# Altium schematic sheet k26_baseboard_power_supply.SchDoc: k26 Baseboard Power Supply (part 1 of 3)
size A3; DrawnBy: Ch. Vogt; Engineer: Ch. Vogt; Organization: PBL; DocumentNumber: 1; Revision: r5; SheetNumber: 4
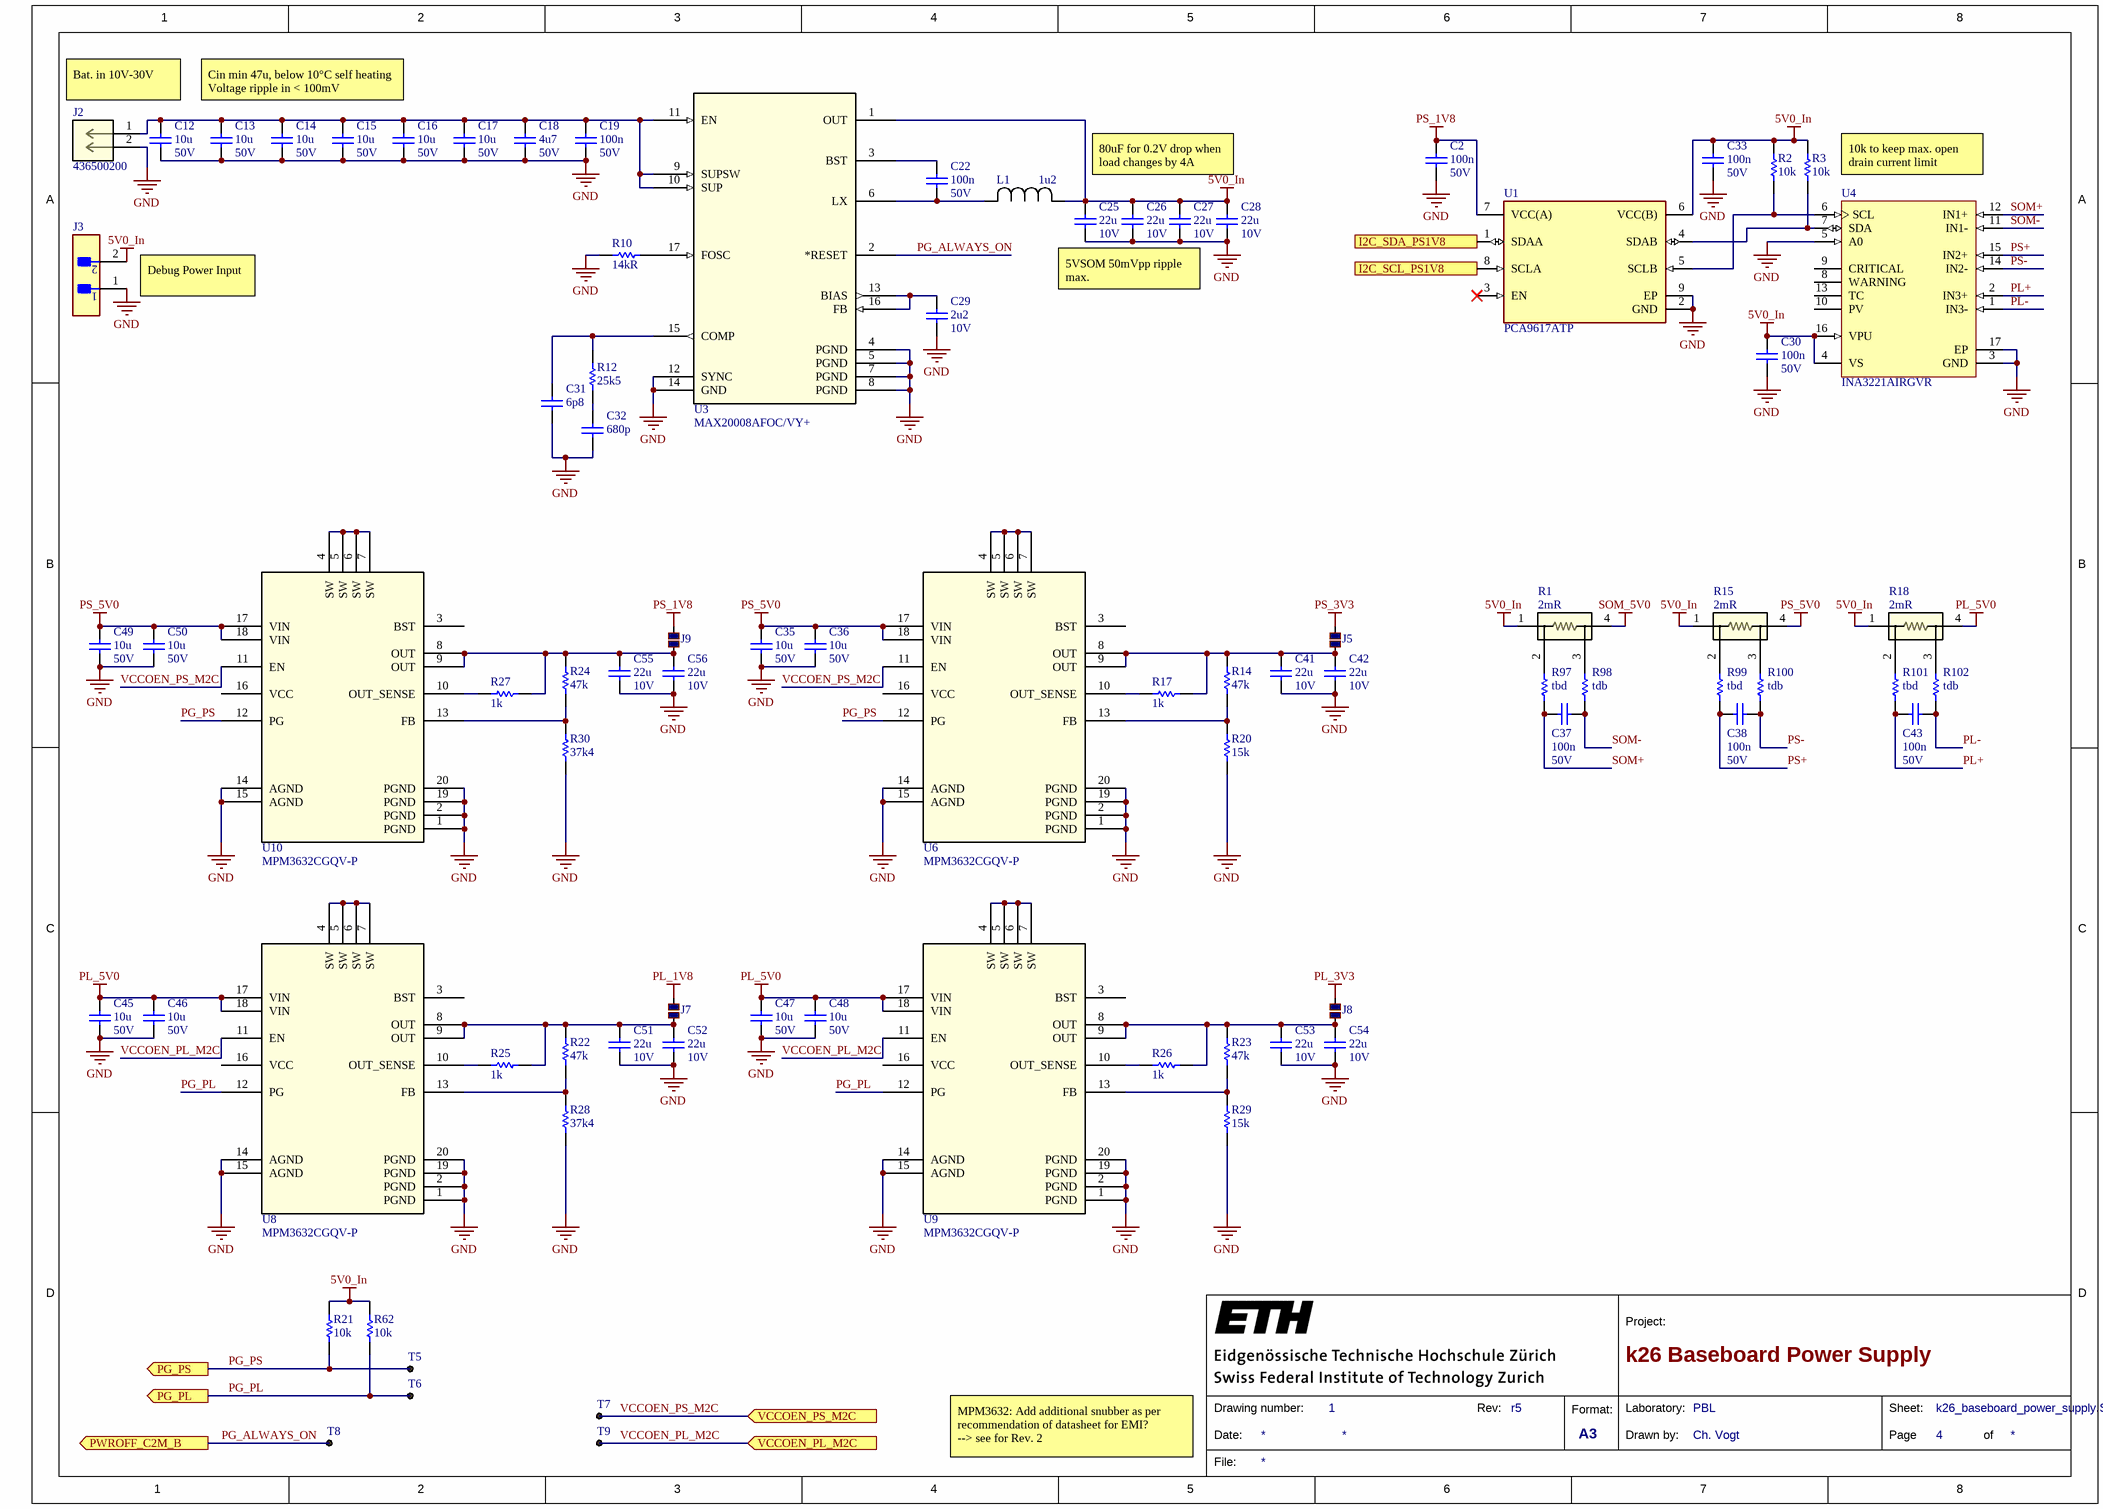
[diagram p0: k26_baseboard_power_supply.SchDoc]

## Parts
C2  100n  Rated DC Voltage (URdc): 50V  [CAPC0402]
C12  10u  Rated DC Voltage (URdc): 50V  [CAPC1206]
C13  10u  Rated DC Voltage (URdc): 50V  [CAPC1206]
C14  10u  Rated DC Voltage (URdc): 50V  [CAPC1206]
C15  10u  Rated DC Voltage (URdc): 50V  [CAPC1206]
C16  10u  Rated DC Voltage (URdc): 50V  [CAPC1206]
C17  10u  Rated DC Voltage (URdc): 50V  [CAPC1206]
C18  4u7  Rated DC Voltage (URdc): 50V  [CAPC1206]
C19  100n  Rated DC Voltage (URdc): 50V  [CAPC0402]
C22  100n  Rated DC Voltage (URdc): 50V  [CAPC0402]
C25  22u  Rated DC Voltage (URdc): 10V  [CAPC1206]
C26  22u  Rated DC Voltage (URdc): 10V  [CAPC1206]
C27  22u  Rated DC Voltage (URdc): 10V  [CAPC1206]
C28  22u  Rated DC Voltage (URdc): 10V  [CAPC1206]
C29  2u2  Rated DC Voltage (URdc): 10V  [CAPC0402]
C30  100n  Rated DC Voltage (URdc): 50V  [CAPC0402]
C31  6p8  [CAPC0402]
C32  680p  [CAPC0402]
C33  100n  Rated DC Voltage (URdc): 50V  [CAPC0402]
C35  10u  Rated DC Voltage (URdc): 50V  [CAPC1206]
C36  10u  Rated DC Voltage (URdc): 50V  [CAPC1206]
C37  100n  Rated DC Voltage (URdc): 50V  [CAPC0402]
C38  100n  Rated DC Voltage (URdc): 50V  [CAPC0402]
C41  22u  Rated DC Voltage (URdc): 10V  [CAPC1206]
C42  22u  Rated DC Voltage (URdc): 10V  [CAPC1206]
C43  100n  Rated DC Voltage (URdc): 50V  [CAPC0402]
C45  10u  Rated DC Voltage (URdc): 50V  [CAPC1206]
C46  10u  Rated DC Voltage (URdc): 50V  [CAPC1206]
C47  10u  Rated DC Voltage (URdc): 50V  [CAPC1206]
C48  10u  Rated DC Voltage (URdc): 50V  [CAPC1206]
C49  10u  Rated DC Voltage (URdc): 50V  [CAPC1206]
C50  10u  Rated DC Voltage (URdc): 50V  [CAPC1206]
C51  22u  Rated DC Voltage (URdc): 10V  [CAPC1206]
C52  22u  Rated DC Voltage (URdc): 10V  [CAPC1206]
C53  22u  Rated DC Voltage (URdc): 10V  [CAPC1206]
C54  22u  Rated DC Voltage (URdc): 10V  [CAPC1206]
C55  22u  Rated DC Voltage (URdc): 10V  [CAPC1206]
C56  22u  Rated DC Voltage (URdc): 10V  [CAPC1206]
J2  436500200  [CON_436500200_MOL]
J3  (no value)  [FP-TSW-102-07-S-S-MFG]
J5  CMP-00005-5  [Big Solder Jumper]  (value not drawn)
J7  CMP-00005-5  [Big Solder Jumper]  (value not drawn)
J8  CMP-00005-5  [Big Solder Jumper]  (value not drawn)
J9  CMP-00005-5  [Big Solder Jumper]  (value not drawn)
L1  Parameter 1: 1u2  [IND_XGL5050_COC]  (hidden comment: XGL5050-122MEC)
R1  res: 2mR  [CST0612-FC-R002E_BRN]  (hidden comment: CST0612-FC-R002E)
R2  10k  [RES0402]
R3  10k  [RES0402]
R10  14kR  [RES0402]
R12  25k5  [RES0402]
R14  47k  [RES0402]
R15  res: 2mR  [CST0612-FC-R002E_BRN]  (hidden comment: CST0612-FC-R002E)
R17  1k  [RES0402]
R18  res: 2mR  [CST0612-FC-R002E_BRN]  (hidden comment: CST0612-FC-R002E)
R20  15k  [RES0402]
R21  10k  [RES0402]
R22  47k  [RES0402]
R23  47k  [RES0402]
R24  47k  [RES0402]
R25  1k  [RES0402]
R26  1k  [RES0402]
R27  1k  [RES0402]
R28  37k4  [RES0402]
R29  15k  [RES0402]
R30  37k4  [RES0402]
R62  10k  [RES0402]
R97  tbd  [RES0402]
R98  tdb  [RES0402]
R99  tbd  [RES0402]
R100  tdb  [RES0402]
R101  tbd  [RES0402]
R102  tdb  [RES0402]
T5  (no value)  [Pad-1mm]  (no BOM)
T6  (no value)  [Pad-1mm]  (no BOM)
T7  (no value)  [Pad-1mm]  (no BOM)
T8  (no value)  [Pad-1mm]  (no BOM)
T9  (no value)  [Pad-1mm]  (no BOM)
U1  PCA9617ATP  [FP-SOT1069-2-MFG]
U3  MAX20008AFOC/VY+  [21-100155B_F173A3FY+1_MXM]
U4  INA3221AIRGVR  [RGV0016A_V]
U6  MPM3632CGQV-P  [QFN3p0x5p0x1p6_MPM3632C_MNP]
U8  MPM3632CGQV-P  [QFN3p0x5p0x1p6_MPM3632C_MNP]
U9  MPM3632CGQV-P  [QFN3p0x5p0x1p6_MPM3632C_MNP]
U10  MPM3632CGQV-P  [QFN3p0x5p0x1p6_MPM3632C_MNP]

## Ports
I2C_SCL_PS1V8, I2C_SDA_PS1V8, PG_PL (out), PG_PS (out), PWROFF_C2M_B (out), VCCOEN_PL_M2C (in), VCCOEN_PS_M2C (in)

## Nets
5V0_In: C25.2 C26.2 C27.2 C28.2 C30.2 C33.2 J3.2 L1.1 R1.1 R2.2 R3.2 R15.1 R18.1 R21.2 R62.2 U1.6(VCC(B)) U3.1(OUT) U4.4(VS) U4.16(VPU)
GND: C2.1 C12.1 C13.1 C14.1 C15.1 C16.1 C17.1 C18.1 C19.1 C25.1 C26.1 C27.1 C28.1 C29.1 C30.1 C31.1 C32.1 C33.1 C35.1 C36.1 C41.1 C42.1 C45.1 C46.1 C47.1 C48.1 C49.1 C50.1 C51.1 C52.1 C53.1 C54.1 C55.1 C56.1 J2.2 J3.1 R10.1 R20.1 R28.1 R29.1 R30.1 U1.2(GND) U1.9(EP) U3.4(PGND) U3.5(PGND) U3.7(PGND) U3.8(PGND) U3.12(SYNC) U3.14(GND) U4.3(GND) U4.5(A0) U4.17(EP) U6.1(PGND) U6.2(PGND) U6.14(AGND) U6.15(AGND) U6.19(PGND) U6.20(PGND) U8.1(PGND) U8.2(PGND) U8.14(AGND) U8.15(AGND) U8.19(PGND) U8.20(PGND) U9.1(PGND) U9.2(PGND) U9.14(AGND) U9.15(AGND) U9.19(PGND) U9.20(PGND) U10.1(PGND) U10.2(PGND) U10.14(AGND) U10.15(AGND) U10.19(PGND) U10.20(PGND)
PL_1V8: J7.1
PL_3V3: J8.1
PL_5V0: C45.2 C46.2 C47.2 C48.2 R18.4 U8.17(VIN) U8.18(VIN) U9.17(VIN) U9.18(VIN)
PS_1V8: C2.2 J9.1 U1.7(VCC(A))
PS_3V3: J5.1
PS_5V0: C35.2 C36.2 C49.2 C50.2 R15.4 U6.17(VIN) U6.18(VIN) U10.17(VIN) U10.18(VIN)
SOM_5V0: R1.4
I2C_SCL_PS1V8: U1.8(SCLA) ; port I2C_SCL_PS1V8
I2C_SDA_PS1V8: U1.1(SDAA) ; port I2C_SDA_PS1V8
PG_ALWAYS_ON: T8.1 U3.2(*RESET) ; port PWROFF_C2M_B
PG_PL: R62.1 T6.1 U8.12(PG) U9.12(PG) ; port PG_PL
PG_PS: R21.1 T5.1 U6.12(PG) U10.12(PG) ; port PG_PS
PL+: C43.2 R101.1 U4.2(IN3+)
PL-: C43.1 R102.1 U4.1(IN3-)
PS+: C38.2 R99.1 U4.15(IN2+)
PS-: C38.1 R100.1 U4.14(IN2-)
SOM+: C37.2 R97.1 U4.12(IN1+)
SOM-: C37.1 R98.1 U4.11(IN1-)
VCCOEN_PL_M2C: T9.1 U8.11(EN) U9.11(EN) ; port VCCOEN_PL_M2C
VCCOEN_PS_M2C: T7.1 U6.11(EN) U10.11(EN) ; port VCCOEN_PS_M2C
NetC12_2: C12.2 C13.2 C14.2 C15.2 C16.2 C17.2 C18.2 C19.2 J2.1 U3.9(SUPSW) U3.10(SUP) U3.11(EN)
NetC22_1: C22.1 L1.2 U3.6(LX)
NetC22_2: C22.2 U3.3(BST)
NetC29_2: C29.2 U3.13(BIAS) U3.16(FB)
NetC31_2: C31.2 R12.2 U3.15(COMP)
NetC32_2: C32.2 R12.1
NetC41_2: C41.2 C42.2 J5.2 R14.2 R17.2 U6.8(OUT) U6.9(OUT)
NetC51_2: C51.2 C52.2 J7.2 R22.2 R25.2 U8.8(OUT) U8.9(OUT)
NetC53_2: C53.2 C54.2 J8.2 R23.2 R26.2 U9.8(OUT) U9.9(OUT)
NetC55_2: C55.2 C56.2 J9.2 R24.2 R27.2 U10.8(OUT) U10.9(OUT)
NetR1_2: R1.2 R97.2
NetR1_3: R1.3 R98.2
NetR2_1: R2.1 U1.5(SCLB) U4.6(SCL)
NetR3_1: R3.1 U1.4(SDAB) U4.7(SDA)
NetR10_2: R10.2 U3.17(FOSC)
NetR14_1: R14.1 R20.2 U6.13(FB)
NetR15_2: R15.2 R99.2
NetR15_3: R15.3 R100.2
NetR17_1: R17.1 U6.10(OUT_SENSE)
NetR18_2: R18.2 R101.2
NetR18_3: R18.3 R102.2
NetR22_1: R22.1 R28.2 U8.13(FB)
NetR23_1: R23.1 R29.2 U9.13(FB)
NetR24_1: R24.1 R30.2 U10.13(FB)
NetR25_1: R25.1 U8.10(OUT_SENSE)
NetR26_1: R26.1 U9.10(OUT_SENSE)
NetR27_1: R27.1 U10.10(OUT_SENSE)
NetU6_4: U6.4(SW) U6.5(SW) U6.6(SW) U6.7(SW)
NetU8_4: U8.4(SW) U8.5(SW) U8.6(SW) U8.7(SW)
NetU9_4: U9.4(SW) U9.5(SW) U9.6(SW) U9.7(SW)
NetU10_4: U10.4(SW) U10.5(SW) U10.6(SW) U10.7(SW)

Not connected (* = marked no-connect by the designer): U1 3(EN)*; U4 8(WARNING) 9(CRITICAL) 10(PV) 13(TC); U6 3(BST) 16(VCC); U8 3(BST) 16(VCC); U9 3(BST) 16(VCC); U10 3(BST) 16(VCC)

## Notes on the sheet
- Bat. in 10V-30V
- Cin min 47u, below 10°C self heating
  Voltage ripple in < 100mV
- 80uF for 0.2V drop when load changes by 4A
- 10k to keep max. open drain current limit
- (near J3) Debug Power Input
- 5VSOM 50mVpp ripple max.
- MPM3632: Add additional snubber as per recommendation of datasheet for EMI?
  --> see for Rev. 2
- 1
- 2
- 3
- 4
- 5
- 6
- 7
- 8
- A
- B
- C
- D
- Project:
- Date:
- Drawing number:
- Rev:
- Format:
- A3
- Drawn by:
- Laboratory:
- Page
- Sheet:
- of
- File: